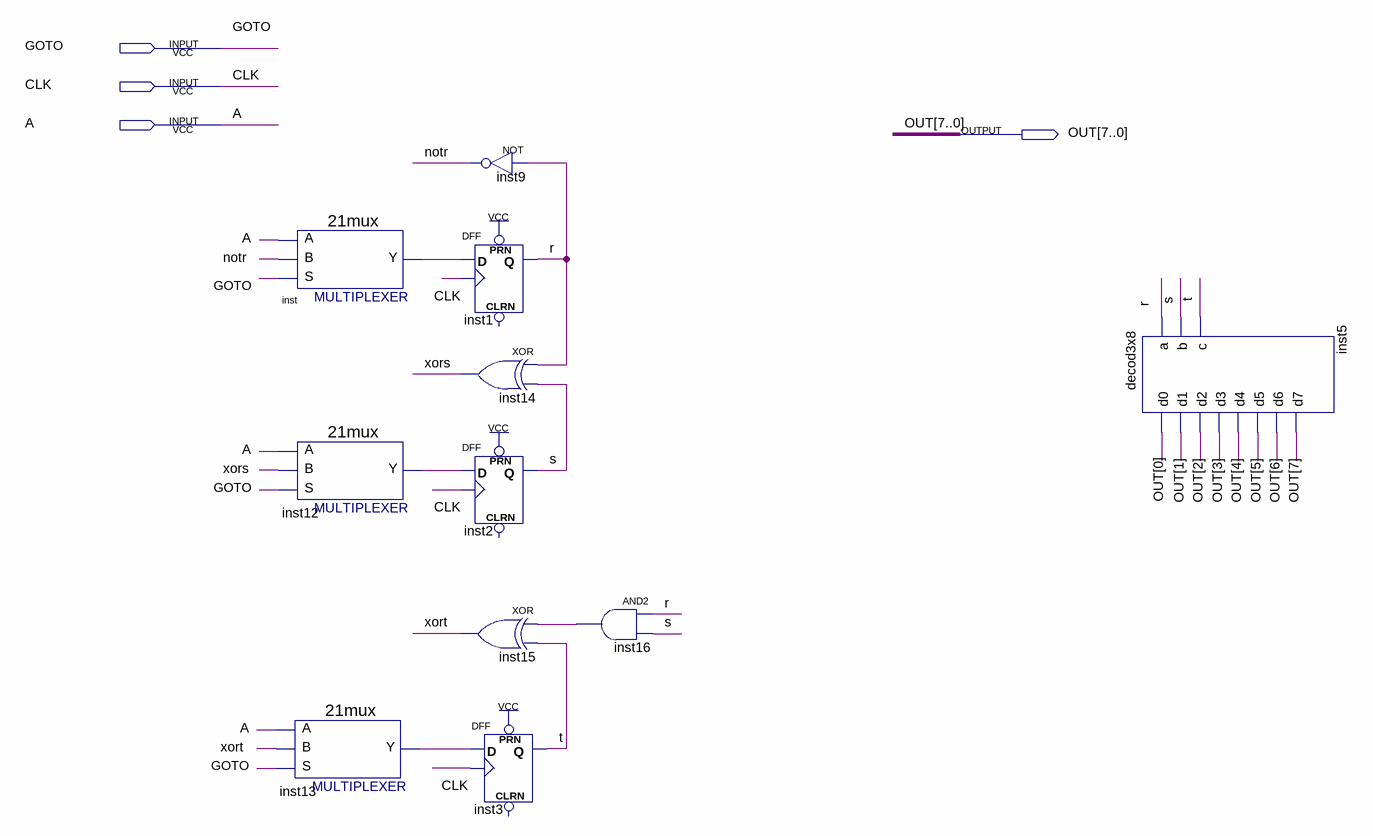
[diagram p0: schematic sheet]
// Quartus schematic temporizador.bdf as structural Verilog: 11 symbols, 4 pins
module temporizador (
  input  GOTO,
  input  CLK,
  input  A,
  output [7:0] OUT
);

  wire inst12_y, inst13_y, inst16_out, inst_y, notr, r, s, t, xors, xort;

  \21mux  inst (.S(GOTO), .B(notr), .A(A), .Y(inst_y));
  \21mux  inst12 (.S(GOTO), .B(xors), .A(A), .Y(inst12_y));
  \21mux  inst13 (.S(GOTO), .B(xort), .A(A), .Y(inst13_y));
  not inst9 (notr, r);
  DFF inst1 (.CLK(CLK), .D(inst_y), .PRN(1'b1), .Q(r));  // open: CLRN
  xor inst14 (xors, r, s);
  DFF inst2 (.CLK(CLK), .D(inst12_y), .PRN(1'b1), .Q(s));  // open: CLRN
  xor inst15 (xort, inst16_out, t);
  DFF inst3 (.CLK(CLK), .D(inst13_y), .PRN(1'b1), .Q(t));  // open: CLRN
  and inst16 (inst16_out, r, s);
  decod3x8 inst5 (
    .a(r), .b(s), .c(t), .d0(OUT[0]), .d1(OUT[1]), .d2(OUT[2]), .d3(OUT[3]), .d4(OUT[4]), .d5(OUT[5]),
    .d6(OUT[6]), .d7(OUT[7]));
endmodule
